# Altium schematic sheet KeyboardMatrix.SchDoc
size A4; SheetNumber: 1; SheetTotal: 1
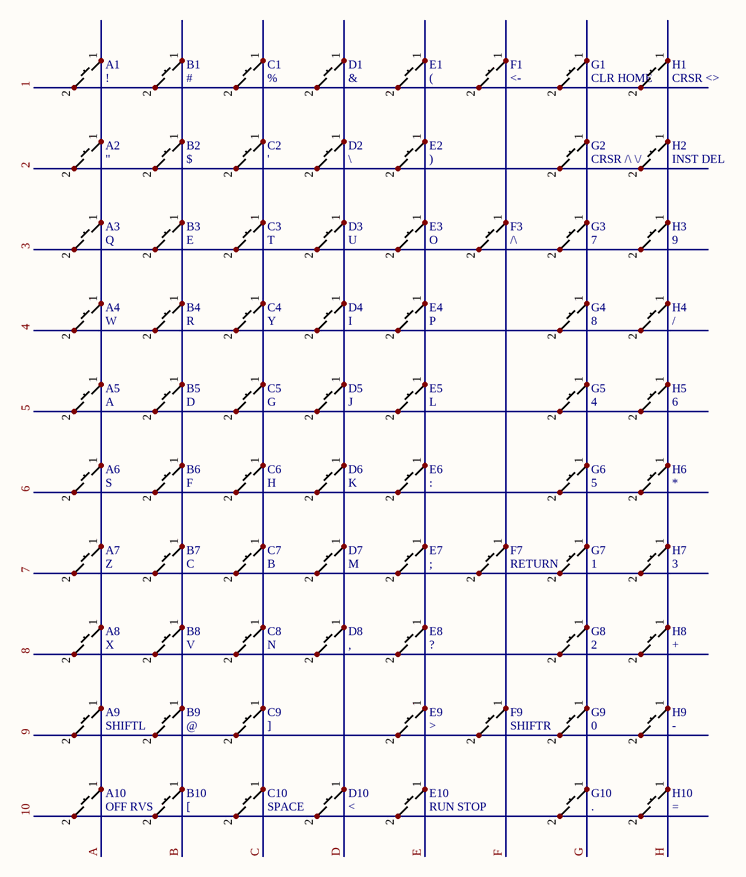
[diagram p0: KeyboardMatrix.SchDoc]

## Parts
A1  !  [PET2001NKeyboardSoftButton]
A2  "  [PET2001NKeyboardSoftButton]
A3  Q  [PET2001NKeyboardSoftButton]
A4  W  [PET2001NKeyboardSoftButton]
A5  A  [PET2001NKeyboardSoftButton]
A6  S  [PET2001NKeyboardSoftButton]
A7  Z  [PET2001NKeyboardSoftButton]
A8  X  [PET2001NKeyboardSoftButton]
A9  SHIFTL  [PET2001NKeyboardSoftButton]
A10  OFF RVS  [PET2001NKeyboardSoftButton]
B1  #  [PET2001NKeyboardSoftButton]
B2  $  [PET2001NKeyboardSoftButton]
B3  E  [PET2001NKeyboardSoftButton]
B4  R  [PET2001NKeyboardSoftButton]
B5  D  [PET2001NKeyboardSoftButton]
B6  F  [PET2001NKeyboardSoftButton]
B7  C  [PET2001NKeyboardSoftButton]
B8  V  [PET2001NKeyboardSoftButton]
B9  @  [PET2001NKeyboardSoftButton]
B10  [  [PET2001NKeyboardSoftButton]
C1  %  [PET2001NKeyboardSoftButton]
C2  '  [PET2001NKeyboardSoftButton]
C3  T  [PET2001NKeyboardSoftButton]
C4  Y  [PET2001NKeyboardSoftButton]
C5  G  [PET2001NKeyboardSoftButton]
C6  H  [PET2001NKeyboardSoftButton]
C7  B  [PET2001NKeyboardSoftButton]
C8  N  [PET2001NKeyboardSoftButton]
C9  ]  [PET2001NKeyboardSoftButton]
C10  SPACE  [PET2001NKeyboardSoftButton]
D1  &  [PET2001NKeyboardSoftButton]
D2  \  [PET2001NKeyboardSoftButton]
D3  U  [PET2001NKeyboardSoftButton]
D4  I  [PET2001NKeyboardSoftButton]
D5  J  [PET2001NKeyboardSoftButton]
D6  K  [PET2001NKeyboardSoftButton]
D7  M  [PET2001NKeyboardSoftButton]
D8  ,  [PET2001NKeyboardSoftButton]
D10  <  [PET2001NKeyboardSoftButton]
E1  (  [PET2001NKeyboardSoftButton]
E2  )  [PET2001NKeyboardSoftButton]
E3  O  [PET2001NKeyboardSoftButton]
E4  P  [PET2001NKeyboardSoftButton]
E5  L  [PET2001NKeyboardSoftButton]
E6  :  [PET2001NKeyboardSoftButton]
E7  ;  [PET2001NKeyboardSoftButton]
E8  ?  [PET2001NKeyboardSoftButton]
E9  >  [PET2001NKeyboardSoftButton]
E10  RUN STOP  [PET2001NKeyboardSoftButton]
F1  <-  [PET2001NKeyboardSoftButton]
F3  /\  [PET2001NKeyboardSoftButton]
F7  RETURN  [PET2001NKeyboardSoftButton]
F9  SHIFTR  [PET2001NKeyboardSoftButton]
G1  CLR HOME  [PET2001NKeyboardSoftButton]
G2  CRSR /\ \/  [PET2001NKeyboardSoftButton]
G3  7  [PET2001NKeyboardSoftButton]
G4  8  [PET2001NKeyboardSoftButton]
G5  4  [PET2001NKeyboardSoftButton]
G6  5  [PET2001NKeyboardSoftButton]
G7  1  [PET2001NKeyboardSoftButton]
G8  2  [PET2001NKeyboardSoftButton]
G9  0  [PET2001NKeyboardSoftButton]
G10  .  [PET2001NKeyboardSoftButton]
H1  CRSR <>  [PET2001NKeyboardSoftButton]
H2  INST DEL  [PET2001NKeyboardSoftButton]
H3  9  [PET2001NKeyboardSoftButton]
H4  /  [PET2001NKeyboardSoftButton]
H5  6  [PET2001NKeyboardSoftButton]
H6  *  [PET2001NKeyboardSoftButton]
H7  3  [PET2001NKeyboardSoftButton]
H8  +  [PET2001NKeyboardSoftButton]
H9  -  [PET2001NKeyboardSoftButton]
H10  (no value)  [PET2001NKeyboardSoftButton]

## Nets
1: A1.2 B1.2 C1.2 D1.2 E1.2 F1.2 G1.2 H1.2
2: A2.2 B2.2 C2.2 D2.2 E2.2 G2.2 H2.2
3: A3.2 B3.2 C3.2 D3.2 E3.2 F3.2 G3.2 H3.2
4: A4.2 B4.2 C4.2 D4.2 E4.2 G4.2 H4.2
5: A5.2 B5.2 C5.2 D5.2 E5.2 G5.2 H5.2
6: A6.2 B6.2 C6.2 D6.2 E6.2 G6.2 H6.2
7: A7.2 B7.2 C7.2 D7.2 E7.2 F7.2 G7.2 H7.2
8: A8.2 B8.2 C8.2 D8.2 E8.2 G8.2 H8.2
9: A9.2 B9.2 C9.2 E9.2 F9.2 G9.2 H9.2
10: A10.2 B10.2 C10.2 D10.2 E10.2 G10.2 H10.2
A: A1.1 A2.1 A3.1 A4.1 A5.1 A6.1 A7.1 A8.1 A9.1 A10.1
B: B1.1 B2.1 B3.1 B4.1 B5.1 B6.1 B7.1 B8.1 B9.1 B10.1
C: C1.1 C2.1 C3.1 C4.1 C5.1 C6.1 C7.1 C8.1 C9.1 C10.1
D: D1.1 D2.1 D3.1 D4.1 D5.1 D6.1 D7.1 D8.1 D10.1
E: E1.1 E2.1 E3.1 E4.1 E5.1 E6.1 E7.1 E8.1 E9.1 E10.1
F: F1.1 F3.1 F7.1 F9.1
G: G1.1 G2.1 G3.1 G4.1 G5.1 G6.1 G7.1 G8.1 G9.1 G10.1
H: H1.1 H2.1 H3.1 H4.1 H5.1 H6.1 H7.1 H8.1 H9.1 H10.1

## Library data of the parts
A1-A10 B1-B10 C1-C10 D1-D8 D10 E1-E10 F1 F3 F7 F9 G1-G10 H1-H10 = PET2001NKeyboardSoftButton